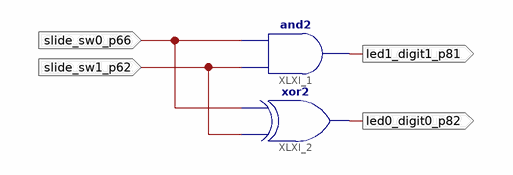
[diagram p0: schematic sheet 1]
// Xilinx ISE schematic halfAdder.sch (spartan6) as structural Verilog: 2 symbols, 4 ports
module halfAdder (
  input  slide_sw0_p66,
  input  slide_sw1_p62,
  output led1_digit1_p81,
  output led0_digit0_p82
);

  and XLXI_1 (led1_digit1_p81, slide_sw1_p62, slide_sw0_p66);
  xor XLXI_2 (led0_digit0_p82, slide_sw1_p62, slide_sw0_p66);
endmodule
